# Altium project DRLDelay.PrjPCB
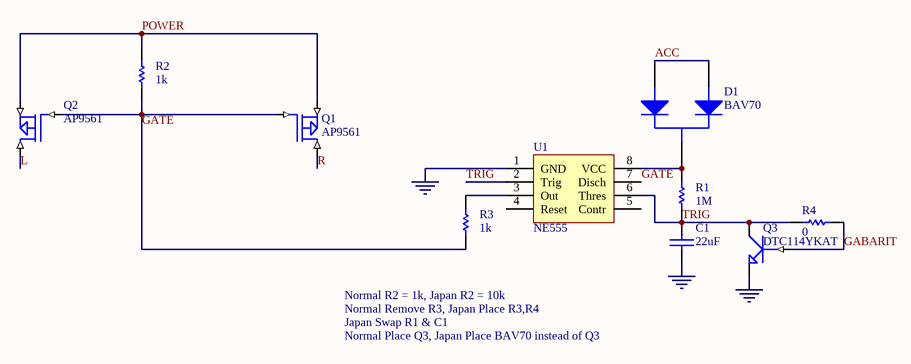
[diagram p0: DRLDelay.SchDoc]
1 sheet, 10 parts. Net scope: global (net labels, ports and power ports of the same name join across sheets).
Board file: DRLDelay.PcbDoc

## Sheet DRLDelay.SchDoc
size A4

### Parts
C1  22uF  [0805]
D1  BAV70  [SOT-23]
Q1  AP9561  [D-Pack]
Q2  AP9561  [D-Pack]
Q3  DTC114YKAT  [SOT-23]
R1  1M  [0805]
R2  1k  [1206]
R3  1k  [0805]
R4  0  [0805]
U1  NE555  [SO-8]

### Nets
PGND: C1.2 Q3.3(E) U1.1(GND)
ACC: D1.1(A1) D1.3(A2)
GABARIT: Q3.1(B) R4.1
GATE: Q1.1(GATE) Q2.1(GATE) R2.2 R3.2 U1.7(Disch)
L: Q2.2(DRAIN)
POWER: Q1.3(SOURCE) Q2.3(SOURCE) R2.1
R: Q1.2(DRAIN)
TRIG: C1.1 Q3.2(C) R1.2 R4.2 U1.2(Trig) U1.6(Thres)
NetD1_2: D1.2(K) R1.1 U1.8(VCC)
NetR3_1: R3.1 U1.3(Out)

Not connected (* = marked no-connect by the designer): U1 4(Reset) 5(Contr)

### Notes on the sheet
- Normal Remove R3, Japan Place R3,R4
- Normal R2 = 1k, Japan R2 = 10k
- Japan Swap R1 & C1
- Normal Place Q3, Japan Place BAV70 instead of Q3

### Library data of the parts
C1 = CAP: Capacitor
D1 = DUAL DIODE BAV70
Q1 Q2 = MOSFET P
Q3 = NPN1: NPN Transistor
R1-R4 = Res1: Resistor; Manufacturer: Generic Components; Class: Passive; Value: 4k7; Published: 08/06/2000; Publisher: Altium Hobart Technology Centre; SubClass: Resistor
U1 = NE555: Timer 555